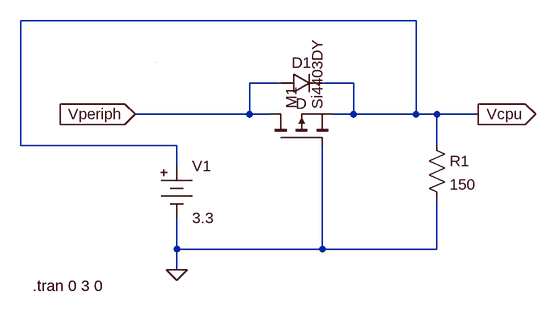
[diagram p0: schematic pfet_as_diode.asc]
pfet_as_diode.asc, the LTspice schematic file:
Version 4
SHEET 1 880 680
WIRE 400 -64 -208 -64
WIRE 192 32 144 32
WIRE 304 32 256 32
WIRE 144 80 144 32
WIRE 144 80 -32 80
WIRE 176 80 144 80
WIRE 304 80 304 32
WIRE 304 80 272 80
WIRE 400 80 400 -64
WIRE 400 80 304 80
WIRE 432 80 400 80
WIRE 496 80 432 80
WIRE -208 128 -208 -64
WIRE 32 128 -208 128
WIRE 432 128 432 80
WIRE 32 160 32 128
WIRE 32 288 32 240
WIRE 256 288 256 128
WIRE 256 288 32 288
WIRE 432 288 432 208
WIRE 432 288 256 288
WIRE 32 320 32 288
WIRE 0 0 0 0
FLAG 32 320 0
FLAG 496 80 Vcpu
IOPIN 496 80 Out
FLAG -32 80 Vperiph
IOPIN -32 80 In
SYMBOL Misc\\battery 32 144 R0
WINDOW 123 0 0 Left 2
WINDOW 39 0 0 Left 2
SYMATTR InstName V1
SYMATTR Value 3.3
SYMBOL diode 192 48 R270
WINDOW 0 32 32 VTop 2
WINDOW 3 0 32 VBottom 2
SYMATTR InstName D1
SYMBOL res 416 112 R0
SYMATTR InstName R1
SYMATTR Value 150
SYMBOL pmos 176 128 R270
SYMATTR InstName M1
SYMATTR Value Si4403DY
TEXT -190 344 Left 2 !.tran 0 3 0

The netlist it stands for:
* pfet_as_diode.asc
V1 Vcpu 0 3.3
D1 Vperiph Vcpu D
R1 Vcpu 0 150
M1 Vperiph 0 Vcpu Vcpu Si4403DY
.model D D
.lib standard.dio
.model NMOS NMOS
.model PMOS PMOS
.lib standard.mos
.tran 0 3 0
.backanno
.end